# EAGLE board radiata_v1 (EAGLE 6.4)
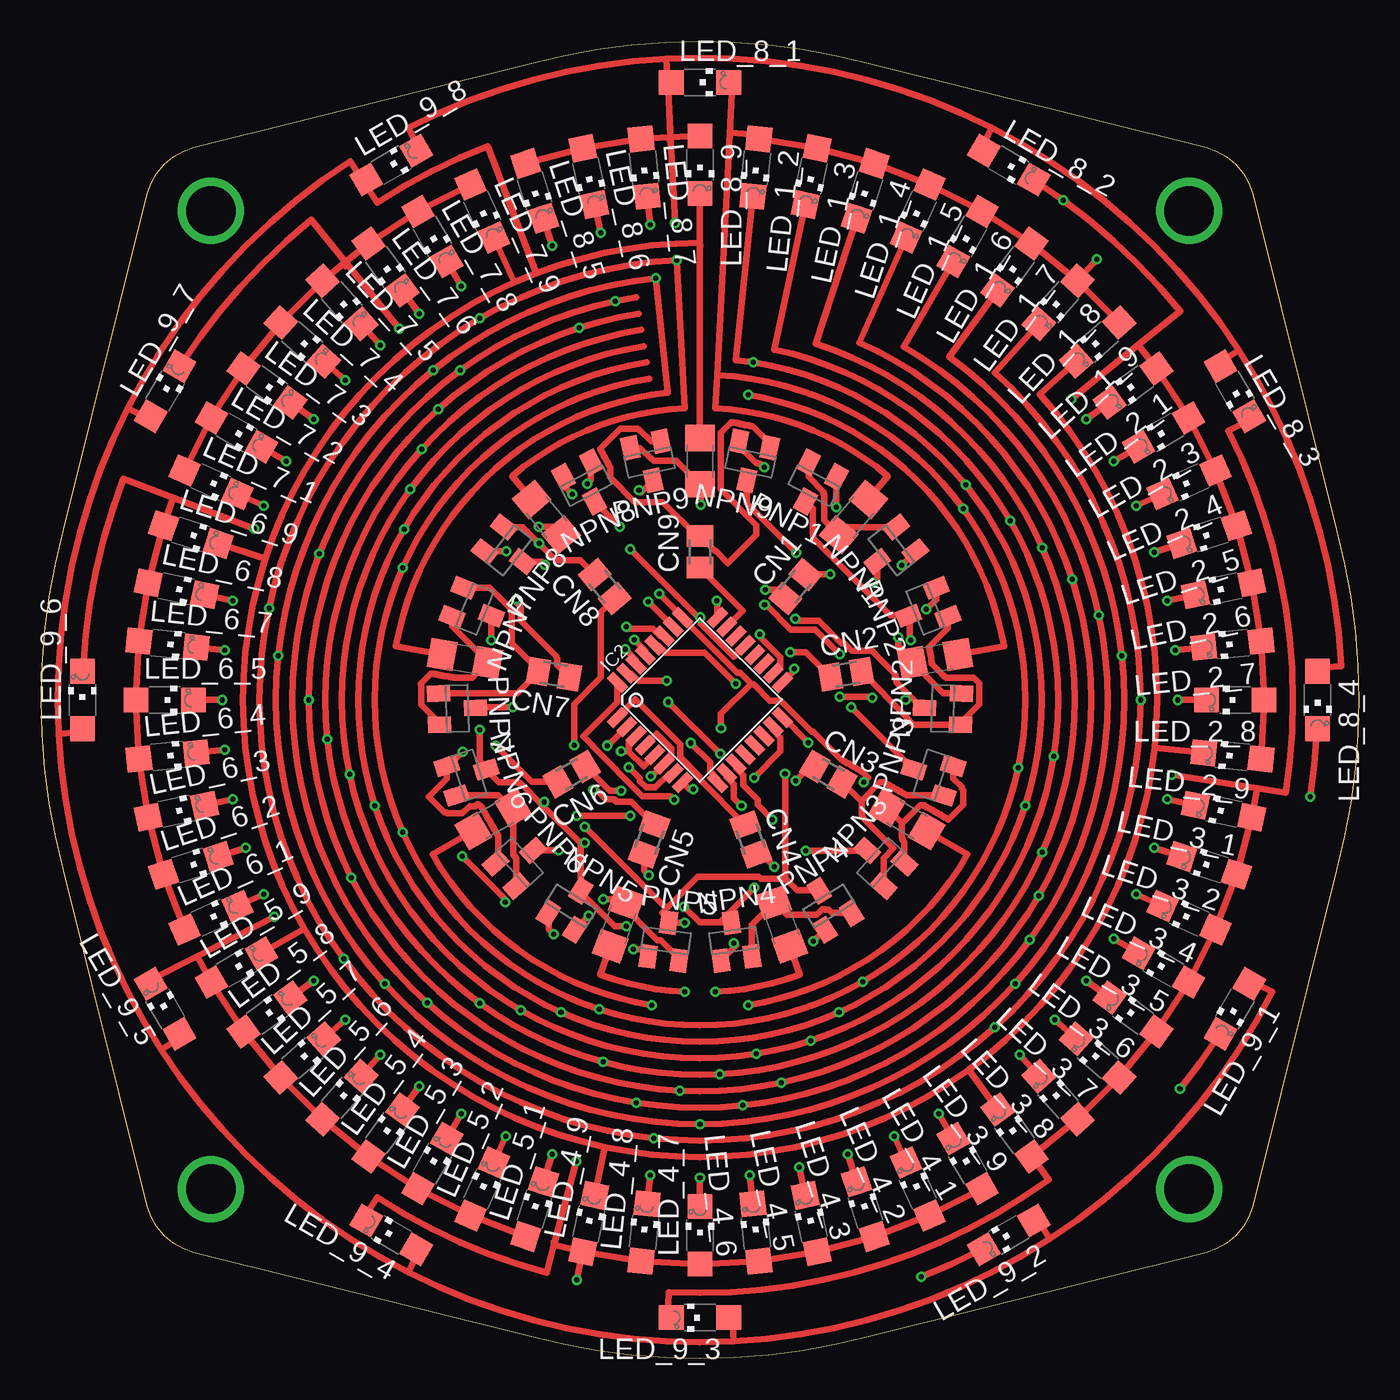
[diagram p1: board, top side]
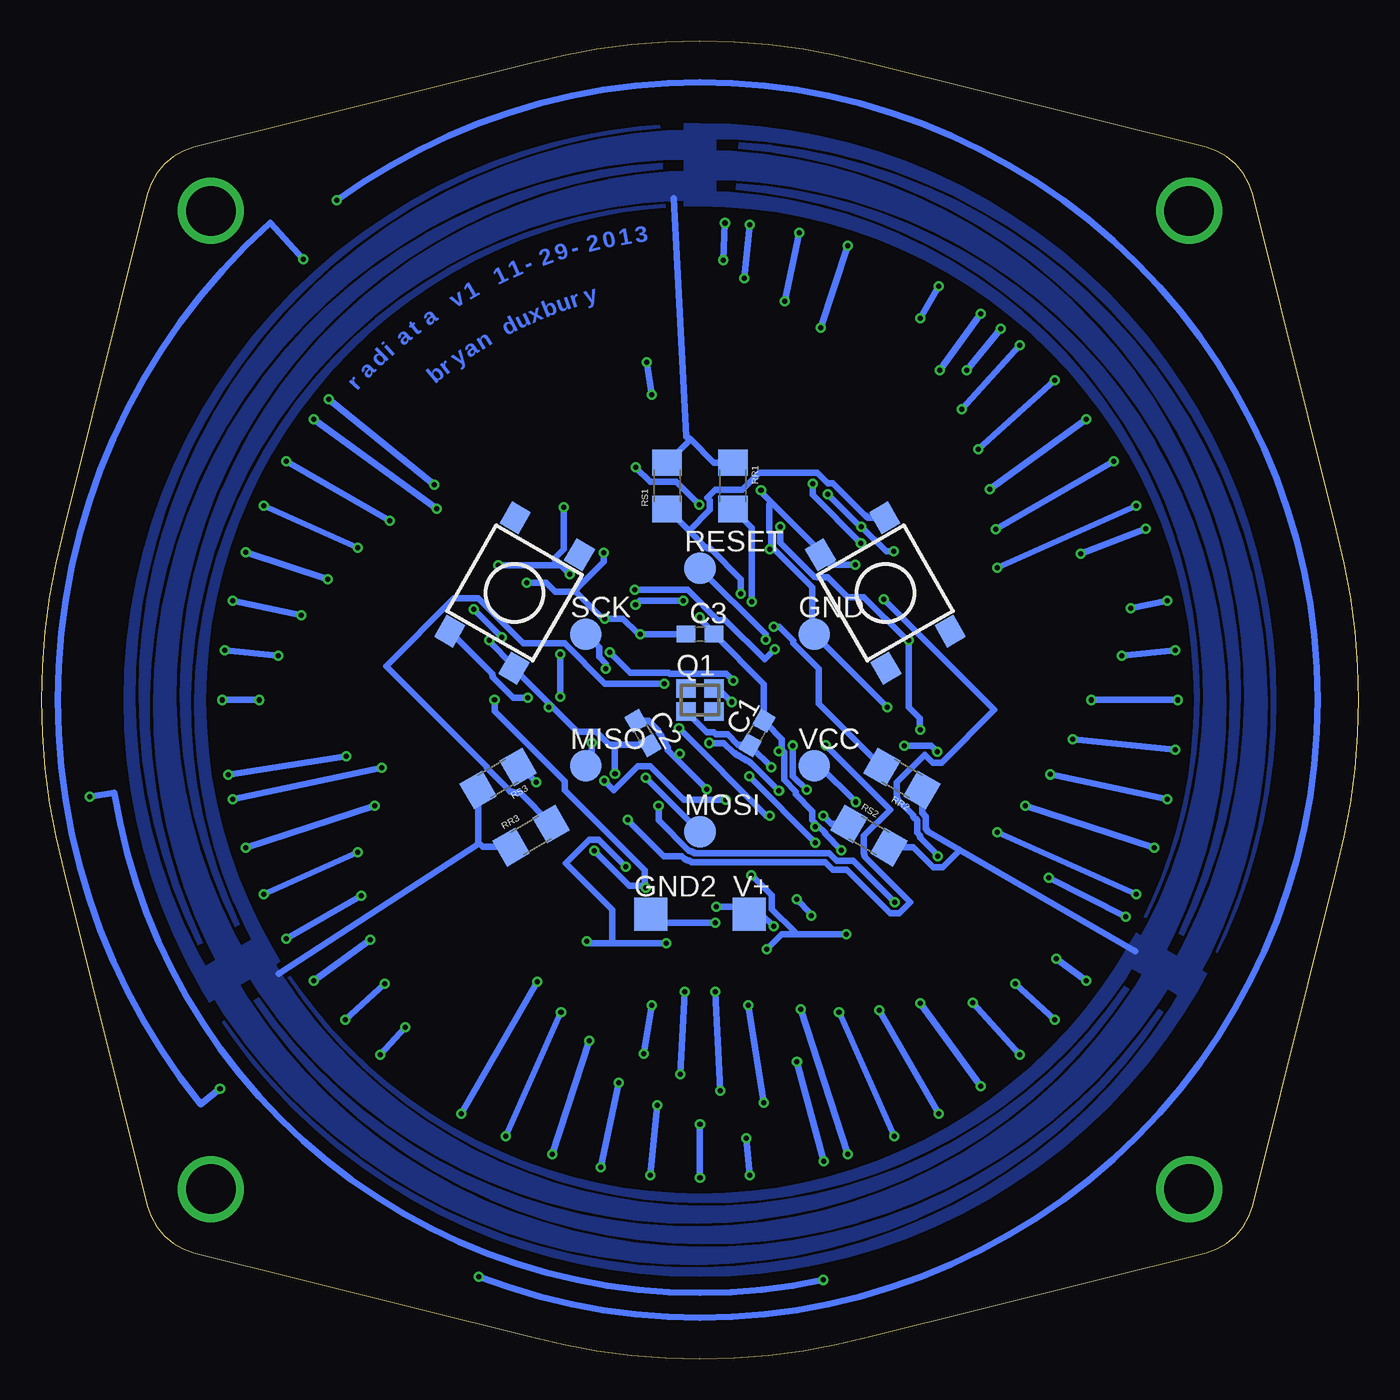
[diagram p2: board, bottom side, seen from below]

Size 80 x 80 mm. Coordinates in mm from the lower left corner, seen from the top.
Outline: 72 segments
Copper layers (1*16): Top 0.035mm / dielectric 0.2mm / Bottom 0.035mm
Design rules "SeeedStudio_DRU_no_angle_20130527 *": minimum track width 8mil, minimum drill 12mil, track to track 6mil, track to pad 6mil, pad to pad 6mil, via to via 6mil, smd to smd 0mil, copper to edge 10mil, drill to drill 10mil, minimum pad ring 6mil, minimum via ring 6mil, stop-mask expansion 2mil, vias tented up to drill 25mil, thermal gap 10mil
bRestrict: area 18.6,19 to 62.5,62.1; area 17.4,39.4 to 20.8,47

## Footprints (pad centres in the part's own frame; a part is rotated, then mirrored left to right if it is on the bottom)
C0603 = smd 1.1 x 1: 1 -0.85,0; 2 0.85,0
M0805 = smd 1.3 x 1.6: 1 -0.95,0; 2 0.95,0
TACTILE_SWITCH_TALL = smd 1.55 x 1.3: A1 -3.975,-2.25; A2 3.975,-2.25; B1 -3.975,2.25; B2 3.975,2.25
TP19R = smd 1.9 x 1.9: TP 0,0
TP20SQ = smd 2 x 2: TP 0,0
TQFP32-08 = smd 1.27 x 0.559: 1 -4.293,2.8; 2 -4.293,2; 3 -4.293,1.2; 4 -4.293,0.4; 5 -4.293,-0.4; 6 -4.293,-1.2; 7 -4.293,-2; 8 -4.293,-2.8; 17 4.293,-2.8; 18 4.293,-2; 19 4.293,-1.2; 20 4.293,-0.4; 21 4.293,0.4; 22 4.293,1.2; 23 4.293,2; 24 4.293,2.8 | smd 0.559 x 1.27: 9 -2.8,-4.293; 10 -2,-4.293; 11 -1.2,-4.293; 12 -0.4,-4.293; 13 0.4,-4.293; 14 1.2,-4.293; 15 2,-4.293; 16 2.8,-4.293; 25 2.8,4.293; 26 2,4.293; 27 1.2,4.293; 28 0.4,4.293; 29 -0.4,4.293; 30 -1.2,4.293; 31 -2,4.293; 32 -2.8,4.293
CHIPLED_1206 = smd 1.5 x 1.5: A 0,-1.75; C 0,1.75
SOT23-BEC = smd 1 x 1.4: B -0.95,-1.1; C 0,1.1; E 0.95,-1.1
FA-20H = smd 1.2 x 1.1: 1 -0.85,-0.7; 2 0.85,-0.7; 3 0.85,0.7; 4 -0.85,0.7
1206 = smd 1.6 x 1.8: 1 -1.4,0; 2 1.4,0

## Placement (x,y rotation side)
C1  [C0603]  36.54,38 60 bottom
C2  [C0603]  43.46,38 300 bottom
C3  [C0603]  40,44 0 bottom
CN1  [M0805]  45.79,46.89 50 top
CN2  [M0805]  48.86,41.56 10 top
CN3  [M0805]  47.79,35.5 330 top
CN4  [M0805]  43.08,31.54 290 top
CN5  [M0805]  36.92,31.54 250 top
CN6  [M0805]  32.21,35.5 210 top
CN7  [M0805]  31.14,41.56 170 top
CN8  [M0805]  34.21,46.89 130 top
CN9  [M0805]  40,49 90 top
DOWNSW  SWITCH-MOMENTARY-2  [TACTILE_SWITCH_TALL]  28.74,46.5 120 bottom
GND  PTR1TP19R  [TP19R]  33.07,44 0 bottom
GND2  PTR1TP20SQ  [TP20SQ]  43,27 0 bottom
IC2  MEGA48/88/168-AU  [TQFP32-08]  40,40 45 top
LED_1_2  [CHIPLED_1206]  43.4,72.32 174 top
LED_1_3  [CHIPLED_1206]  46.76,71.79 168 top
LED_1_4  [CHIPLED_1206]  50.04,70.91 162 top
LED_1_5  [CHIPLED_1206]  53.22,69.69 156 top
LED_1_6  [CHIPLED_1206]  56.25,68.15 150 top
LED_1_7  [CHIPLED_1206]  59.1,66.29 144 top
LED_1_8  [CHIPLED_1206]  61.75,64.15 138 top
LED_1_9  [CHIPLED_1206]  64.15,61.75 132 top
LED_2_1  [CHIPLED_1206]  66.29,59.1 126 top
LED_2_3  [CHIPLED_1206]  68.15,56.25 120 top
LED_2_4  [CHIPLED_1206]  69.69,53.22 114 top
LED_2_5  [CHIPLED_1206]  70.91,50.04 108 top
LED_2_6  [CHIPLED_1206]  71.79,46.76 102 top
LED_2_7  [CHIPLED_1206]  72.32,43.4 96 top
LED_2_8  [CHIPLED_1206]  72.5,40 90 top
LED_2_9  [CHIPLED_1206]  72.32,36.6 84 top
LED_3_1  [CHIPLED_1206]  71.79,33.24 78 top
LED_3_2  [CHIPLED_1206]  70.91,29.96 72 top
LED_3_4  [CHIPLED_1206]  69.69,26.78 66 top
LED_3_5  [CHIPLED_1206]  68.15,23.75 60 top
LED_3_6  [CHIPLED_1206]  66.29,20.9 54 top
LED_3_7  [CHIPLED_1206]  64.15,18.25 48 top
LED_3_8  [CHIPLED_1206]  61.75,15.85 42 top
LED_3_9  [CHIPLED_1206]  59.1,13.71 36 top
LED_4_1  [CHIPLED_1206]  56.25,11.85 30 top
LED_4_2  [CHIPLED_1206]  53.22,10.31 24 top
LED_4_3  [CHIPLED_1206]  50.04,9.09 18 top
LED_4_5  [CHIPLED_1206]  46.76,8.21 12 top
LED_4_6  [CHIPLED_1206]  43.4,7.68 6 top
LED_4_7  [CHIPLED_1206]  40,7.5 0 top
LED_4_8  [CHIPLED_1206]  36.6,7.68 354 top
LED_4_9  [CHIPLED_1206]  33.24,8.21 348 top
LED_5_1  [CHIPLED_1206]  29.96,9.09 342 top
LED_5_2  [CHIPLED_1206]  26.78,10.31 336 top
LED_5_3  [CHIPLED_1206]  23.75,11.85 330 top
LED_5_4  [CHIPLED_1206]  20.9,13.71 324 top
LED_5_6  [CHIPLED_1206]  18.25,15.85 318 top
LED_5_7  [CHIPLED_1206]  15.85,18.25 312 top
LED_5_8  [CHIPLED_1206]  13.71,20.9 306 top
LED_5_9  [CHIPLED_1206]  11.85,23.75 300 top
LED_6_1  [CHIPLED_1206]  10.31,26.78 294 top
LED_6_2  [CHIPLED_1206]  9.09,29.96 288 top
LED_6_3  [CHIPLED_1206]  8.21,33.24 282 top
LED_6_4  [CHIPLED_1206]  7.68,36.6 276 top
LED_6_5  [CHIPLED_1206]  7.5,40 270 top
LED_6_7  [CHIPLED_1206]  7.68,43.4 264 top
LED_6_8  [CHIPLED_1206]  8.21,46.76 258 top
LED_6_9  [CHIPLED_1206]  9.09,50.04 252 top
LED_7_1  [CHIPLED_1206]  10.31,53.22 246 top
LED_7_2  [CHIPLED_1206]  11.85,56.25 240 top
LED_7_3  [CHIPLED_1206]  13.71,59.1 234 top
LED_7_4  [CHIPLED_1206]  15.85,61.75 228 top
LED_7_5  [CHIPLED_1206]  18.25,64.15 222 top
LED_7_6  [CHIPLED_1206]  20.9,66.29 216 top
LED_7_8  [CHIPLED_1206]  23.75,68.15 210 top
LED_7_9  [CHIPLED_1206]  26.78,69.69 204 top
LED_8_1  [CHIPLED_1206]  40,77.5 270 top
LED_8_2  [CHIPLED_1206]  58.75,72.48 240 top
LED_8_3  [CHIPLED_1206]  72.48,58.75 210 top
LED_8_4  [CHIPLED_1206]  77.5,40 180 top
LED_8_5  [CHIPLED_1206]  29.96,70.91 198 top
LED_8_6  [CHIPLED_1206]  33.24,71.79 192 top
LED_8_7  [CHIPLED_1206]  36.6,72.32 186 top
LED_8_9  [CHIPLED_1206]  40,72.5 180 top
LED_9_1  [CHIPLED_1206]  72.48,21.25 150 top
LED_9_2  [CHIPLED_1206]  58.75,7.52 120 top
LED_9_3  [CHIPLED_1206]  40,2.5 90 top
LED_9_4  [CHIPLED_1206]  21.25,7.52 60 top
LED_9_5  [CHIPLED_1206]  7.52,21.25 30 top
LED_9_6  [CHIPLED_1206]  2.5,40 0 top
LED_9_7  [CHIPLED_1206]  7.52,58.75 330 top
LED_9_8  [CHIPLED_1206]  21.25,72.48 300 top
MISO  PTR1TP19R  [TP19R]  46.93,36 0 bottom
MOSI  PTR1TP19R  [TP19R]  40,32 0 bottom
NPN1  [SOT23-BEC]  51.62,49.08 128 top
NPN2  [SOT23-BEC]  54.74,39.49 88 top
NPN3  [SOT23-BEC]  50.96,30.13 48 top
NPN4  [SOT23-BEC]  42.05,25.39 8 top
NPN5  [SOT23-BEC]  32.18,27.49 328 top
NPN6  [SOT23-BEC]  25.97,35.44 288 top
NPN7  [SOT23-BEC]  26.32,45.53 248 top
NPN8  [SOT23-BEC]  33.08,53.02 208 top
NPN9  [SOT23-BEC]  43.07,54.43 168 top
PNP1  [SOT23-BEC]  46.92,53.02 152 top
PNP2  [SOT23-BEC]  53.68,45.53 112 top
PNP3  [SOT23-BEC]  54.03,35.44 72 top
PNP4  [SOT23-BEC]  47.82,27.49 32 top
PNP5  [SOT23-BEC]  37.95,25.39 352 top
PNP6  [SOT23-BEC]  29.04,30.13 312 top
PNP7  [SOT23-BEC]  25.26,39.49 272 top
PNP8  [SOT23-BEC]  28.38,49.08 232 top
PNP9  [SOT23-BEC]  36.93,54.43 192 top
Q1  FA-20H  [FA-20H]  40,40 0 bottom
RESET  PTR1TP19R  [TP19R]  40,48 0 bottom
RN1  [1206]  49.32,51.11 50 top
RN2  [1206]  54.28,42.52 10 top
RN3  [1206]  52.56,32.75 330 top
RN4  [1206]  44.96,26.37 290 top
RN5  [1206]  35.04,26.37 250 top
RN6  [1206]  27.44,32.75 210 top
RN7  [1206]  25.72,42.52 170 top
RN8  [1206]  30.68,51.11 130 top
RN9  [1206]  40,54.5 90 top
RR1  [1206]  38,53 270 bottom
RR2  [1206]  27.74,35.23 150 bottom
RR3  [1206]  50.26,31.77 30 bottom
RS1  [1206]  42,53 90 bottom
RS2  [1206]  29.74,31.77 330 bottom
RS3  [1206]  52.26,35.23 210 bottom
SCK  PTR1TP19R  [TP19R]  46.93,44 0 bottom
UPSW  SWITCH-MOMENTARY-2  [TACTILE_SWITCH_TALL]  51.26,46.5 240 bottom
V+  PTR1TP20SQ  [TP20SQ]  37,27 0 bottom
VCC  PTR1TP19R  [TP19R]  33.07,36 0 bottom

## Tracks (layer width: path | path; a pad name or v marks a point on that pad's centre or on a via)
GND  (via drill 0.3)
  Top 0.381: PNP1.C 46.43,52.05 46.84,51.64 46.84,50.11 46.86,50.09 46.86,49.84 51.56,45.14 52.65,45.14 PNP2.C 52.73,44.93 52.73,43.71 v52.81,43.64 | v49.17,39.55 52.93,35.79 52.96,35.79 PNP3.C | v28.63,39.55 26.36,39.55 PNP7.C | v30.58,48.21 30.4,48.39 29.26,48.39 PNP8.C | v36.3,52.73 36.42,52.6 PNP9.C | v39.06,26.47 38.12,26.47 PNP5.C 38.1,26.67 37.69,27.08 37.97,27.36 | 45.11,29.13 45.16,29.08 45.21,29.08 45.26,29.03 45.31,29.03 45.9,28.45 47.22,28.45 PNP4.C | 45.11,29.13 43.69,29.13 43.56,29.26 39.88,29.26 37.97,27.36 | 37.24,36.68 IC2.5 37.13,36.52 36.58,35.97 35.69,36.85 | IC2.3 35.99,37.67 35.69,37.36 35.69,36.85 | IC2.21 42.75,43.31 42.06,42.62 40.06,44.63 40.06,44.96 v40.01,45.01 39.83,45.09 v35.76,49.15 | v31.42,30.89 29.87,30.89 PNP6.C | v35.2,36.88 35.51,36.88 35.69,36.85 | v32.99,32.31 37.82,27.48 37.85,27.48 37.97,27.36 | v45.16,35.53 45.16,29.31 45.11,29.13
  Bottom 0.381: 45.16,37.29 45.52,37.29 46.3,38.08 47.45,38.08 49.05,39.67 | 45.16,37.29 43.05,37.29 C2.2 | 49.05,39.67 51.28,41.91 UPSW.B2 51.36,42.11 52.81,43.56 v52.81,43.64 | v49.17,39.55 49.05,39.67 | v28.63,39.55 GND.TP 33.17,44.17 33.17,46.84 35.61,49.28 | v30.58,48.21 32.08,48.21 32.66,48.79 DOWNSW.B2 32.66,49 35.66,51.99 | v36.3,52.73 36.3,52.63 35.66,51.99 | 35.61,49.28 35.66,49.33 35.66,50.11 35.79,50.24 35.79,51.87 35.66,51.99 | v39.06,26.47 42.47,26.47 42.98,26.98 GND2.TP | v40.01,45.01 40.01,44.93 39.24,44.17 C3.2 36.12,40.97 36.12,38.76 C1.2 35.99,38.58 35.03,37.62 35.03,36.96 | v31.42,30.89 32.41,31.88 32.41,31.93 32.89,32.41 | 32.89,32.41 33.17,32.69 33.17,33.25 34.19,34.27 34.19,34.44 34.9,35.15 34.9,36.83 35.03,36.96 | v35.2,36.88 35.03,36.96 | v32.99,32.31 32.89,32.41 | v35.76,49.15 35.74,49.15 35.61,49.28 | v45.16,35.53 45.16,37.29
N$1  (via drill 3)
  other vias: 10.3,10.3
N$2  (via drill 3)
  other vias: 10.3,69.7
N$3  (via drill 3)
  other vias: 69.7,69.7
N$4  (via drill 3)
  other vias: 69.7,10.3
N$5  (via drill 0.3)
  Top 0.381: v36.02,43.66 36.68,43 36.68,42.77 IC2.29
  Bottom 0.381: v36.02,43.66 36.02,43.99 40.01,47.98 RESET.TP
N$6  (via drill 0.3)
  Top 0.381: v45.72,41.91 45.8,41.83 45.03,41.07 IC2.17
  Bottom 0.381: v45.72,41.91 45.72,42.22 46.13,42.62 46.13,43.2 46.91,43.99 SCK.TP
N$7  (via drill 0.3)
  Top 0.381: v46.58,37.41 45.06,38.94 45.03,38.94 IC2.16
  Bottom 0.381: v46.58,37.41 46.58,36.35 46.91,36.02 MISO.TP
N$8  (via drill 0.3)
  Top 0.381: v43.28,35.28 44.88,36.88 44.88,37.72 44.45,38.15 44.45,38.35 IC2.15
  Bottom 0.381: v43.28,35.28 MOSI.TP
N$9
  Top 0.381: PNP1.E 46.61,53.54 47.5,52.65 47.5,52.58 47.52,52.55 47.52,52.5 47.55,52.48 47.55,50.9 RN1.1 48.21,50.49 51.89,50.49 NPN1.E
N$10  (via drill 0.3)
  Top 0.381: v52.25,48.18 53.06,49 NPN1.B | v47.9,47.62 CN1.2 | v48.28,51.69 PNP1.B
  Bottom 0.381: 48.62,48.18 48.46,48.18 v47.9,47.62 | 48.62,48.18 v52.25,48.18 | v48.28,51.69 48.28,49.15 48.84,48.59 48.62,48.36 48.62,48.18
N$11  (via drill 0.3)
  Top 0.381: NPN2.E 55.85,40.41 54.76,40.41 RN2.1 52.86,42.47 52.05,43.28 v52.05,43.81 | v53.75,45.52 54.33,46.1 PNP2.E
  Bottom 0.381: v52.05,43.81 v53.75,45.52
N$12
  Top 0.381: CN2.2 49.81,41.71 52.55,38.96 52.55,38.91 52.96,38.51 NPN2.B 55.88,38.68 56.95,39.75 56.95,41.02 56.62,41.35 54.94,41.35 54.86,41.43 54.81,41.43 54.69,41.55 54.69,41.58 54.08,42.19 54.08,42.32 54.05,42.34 54.05,42.47 54.03,42.49 54.03,42.62 54,42.65 54,42.75 53.98,42.77 53.98,42.9 53.95,42.93 53.95,43.05 53.92,43.08 53.92,43.18 53.9,43.2 55.04,44.35 55.04,45.03 PNP2.B
N$13
  Top 0.381: 52.25,32.54 52.25,31.67 52.27,31.65 52.27,31.57 52.3,31.55 52.3,31.47 52.4,31.37 52.4,30.12 NPN3.E | 52.25,32.54 51.36,33.43 RN3.1 | PNP3.E 55.37,35.99 55.37,35.23 55.88,34.72 55.88,34.67 55.93,34.62 55.93,34.57 55.98,34.52 55.98,33.66 55.07,32.74 54.99,32.82 54.94,32.82 54.86,32.89 54.81,32.89 54.76,32.94 54.71,32.94 54.63,33.02 54.59,33.02 54.51,33.1 54.46,33.1 54.41,33.15 54.36,33.15 54.28,33.22 54.23,33.22 54.15,33.3 54.1,33.3 54.03,33.38 53.98,33.38 53.92,33.43 53.87,33.43 53.8,33.5 53.75,33.5 53.67,33.58 53.62,33.58 53.59,33.6 53.37,33.6 52.4,32.64 52.25,32.54
N$14
  Top 0.381: 49.81,33.83 49.81,33.12 49.84,33.1 49.84,33.05 49.86,33.02 49.86,32.94 49.89,32.92 49.89,32.84 51.74,30.99 51.16,30.4 51.16,28.7 NPN3.B | 49.81,33.83 48.64,35 CN3.2 | PNP3.B 54.76,34.21 52.53,34.21 52.48,34.27 52.43,34.27 52.35,34.34 52.3,34.34 52.22,34.42 52.17,34.42 52.12,34.47 52.07,34.47 51.99,34.54 51.94,34.54 51.87,34.62 51.82,34.62 51.74,34.7 51.69,34.7 51.64,34.75 51.59,34.75 51.51,34.82 51.46,34.82 51.38,34.9 51.33,34.9 51.26,34.98 51.21,34.98 51.18,35 50.93,35 49.91,33.98 49.81,33.83
N$15
  Top 0.381: NPN4.E 43.16,24.46 43.16,26.36 RN4.1 44.65,27.58 45.26,26.98 47.09,26.98 47.42,27.3 47.57,27.3 47.6,27.28 47.68,27.28 47.7,27.25 47.83,27.25 48.01,27.08 49.2,27.08 PNP4.E
N$16  (via drill 0.3)
  Top 0.381: v42.06,25.22 42.19,25.09 41.27,24.18 NPN4.B | v46.89,25.35 47.57,26.04 PNP4.B | v44.5,29.87 43.74,30.63 43.41,30.63 CN4.2
  Bottom 0.381: 45.34,25.22 46.76,25.22 v46.89,25.35 | 45.34,25.22 v42.06,25.22 | v44.5,29.87 46.15,31.52 46.71,31.52 48.16,30.07 45.34,27.25 45.34,25.22
N$17  (via drill 0.3)
  Top 0.381: v33.25,26.9 NPN5.E | v34.14,27.89 35.33,27.89 35.51,27.71 RN5.1 35.13,27.71 37.41,25.43 37.49,25.43 37.52,25.4 37.62,25.4 38.71,24.31 38.71,24.18 PNP5.E
  Bottom 0.381: v33.25,26.9 33.25,27 v34.14,27.89
N$18  (via drill 0.3)
  Top 0.381: v31.11,25.78 30.81,26.09 NPN5.B | v35.94,24.87 36.42,24.87 36.83,24.46 PNP5.B | v36.88,29.36 36.6,29.64 36.6,30.63 CN5.2
  Bottom 0.381: 34.29,25.78 35.03,25.78 v35.94,24.87 | 34.29,25.78 v31.11,25.78 | v36.88,29.36 36.85,29.36 35.64,28.14 35.64,27.3 34.29,25.96 34.29,25.78
N$19
  Top 0.381: PNP6.E 28.85,28.7 28.85,30.4 28.65,30.61 28.65,33.43 RN6.1 28.47,33.5 27.76,34.21 25.22,34.21 NPN6.E
N$20  (via drill 0.3)
  Top 0.381: PNP6.B 27.61,30.12 27.76,30.28 27.76,31.75 27.69,31.83 27.69,31.88 27.61,31.95 27.61,32 27.53,32.08 27.53,32.13 27.48,32.18 27.48,32.23 27.41,32.31 27.41,32.36 27.33,32.44 27.33,32.49 27.25,32.56 27.25,32.61 27.2,32.66 27.2,32.72 27.13,32.79 27.13,32.84 27.05,32.92 27.05,32.97 27,33.02 27,33.07 26.92,33.15 26.92,33.2 26.85,33.27 26.85,33.33 26.77,33.4 26.77,33.45 26.54,33.68 26.47,33.68 26.34,33.55 26.01,33.55 25.58,33.12 24.66,33.12 24.64,33.15 24.59,33.15 24.54,33.2 24.49,33.2 23.55,34.14 24.61,35.2 24.61,35.99 NPN6.B 24.82,36.07 v25.6,36.85 | v27.61,37.21 29.79,35.03 CN6.2
  Bottom 0.381: v27.61,37.21 25.96,37.21 v25.6,36.85
N$24
  Top 0.381: PNP7.E 24.18,38.63 23.09,39.73 23.09,40.23 23.06,40.26 23.06,40.95 23.04,40.97 23.04,41 23.65,41.6 23.72,41.6 23.75,41.58 23.88,41.58 23.9,41.55 24,41.55 24.03,41.53 24.16,41.53 24.18,41.5 24.31,41.5 24.33,41.48 24.43,41.48 24.46,41.45 24.59,41.45 24.61,41.43 24.74,41.43 24.77,41.4 24.87,41.4 24.89,41.38 25.02,41.38 25.04,41.35 26.16,41.35 27.08,42.27 RN7.1 27,42.44 24.97,44.48 24.97,45.03 NPN7.E
N$25
  Top 0.381: PNP7.B 24.13,40.41 28.91,40.41 30.2,41.71 CN7.2 30.12,41.91 28.57,43.46 28.57,45.34 28.52,45.39 28.52,45.47 28.47,45.52 28.47,45.57 27.23,46.81 25.68,46.81 NPN7.B
N$26  (via drill 0.3)
  Top 0.381: v28.25,49.02 26.95,49.02 PNP8.E | v30.2,50.52 31.09,50.52 RN8.1 | v32.23,52.5 31.73,53.01 NPN8.E
  Bottom 0.381: v28.25,49.02 28.7,49.02 v30.2,50.52 30.35,50.62 v32.23,52.5
N$27  (via drill 0.3)
  Top 0.381: 30.21,49.52 31.24,48.49 32.74,48.49 CN8.2 | 30.21,49.52 29.23,50.49 28.12,50.49 PNP8.B | v33.15,53.14 33.38,53.37 33.38,54.43 NPN8.B | v30.23,49.53 30.21,49.52
  Bottom 0.381: v33.15,53.14 33.15,52.45 v30.23,49.53
N$28  (via drill 0.3)
  Top 0.381: PNP9.E 35.79,55.3 36.37,55.3 37.03,54.63 37.08,54.63 37.19,54.53 38.56,54.53 39.98,53.11 RN9.1 40.01,52.91 40.06,52.86 v40.06,51.84 | v43.89,54.13 43.66,54.36 43.56,54.36 43.54,54.38 43.46,54.38 43.43,54.41 43.38,54.41 42.37,55.42 42.37,55.68 NPN9.E
  Bottom 0.381: v43.89,54.13 43.89,54.1 43.03,53.24 41.45,53.24 v40.06,51.84
N$29
  Top 0.381: NPN9.B 44.22,55.6 43.2,56.62 43.08,56.62 43.05,56.64 42.98,56.64 42.95,56.67 42.85,56.67 42.82,56.69 42.72,56.69 42.7,56.72 42.62,56.72 42.6,56.74 42.49,56.74 42.47,56.77 42.37,56.77 42.34,56.79 42.24,56.79 42.22,56.82 42.14,56.82 42.11,56.84 42.01,56.84 41.99,56.87 41.88,56.87 41.25,56.24 41.25,52.78 43.41,50.62 43.41,50.04 41.68,48.31 40.95,49.05 40.89,49.05 40.01,49.94 CN9.2 39.8,49.96 37.74,52.02 36.04,52.02 34.54,53.52 34.54,54.13 34.49,54.18 34.49,54.23 34.44,54.28 34.44,54.33 34.39,54.38 34.39,54.43 34.34,54.48 34.34,54.53 34.27,54.61 34.27,54.66 34.21,54.71 34.21,54.76 34.16,54.81 34.16,54.86 34.09,54.94 34.09,54.99 34.04,55.04 34.04,55.09 33.98,55.14 33.98,55.19 33.93,55.24 35.15,56.46 36.22,56.46 36.27,56.41 36.32,56.41 37.03,55.7 37.62,55.7 PNP9.B
N_1  (via drill 0.3)
  Top 0.381: LED_1_8.A LED_1_7.A LED_1_6.A LED_1_5.A LED_1_4.A LED_1_3.A LED_1_2.A 43.51,74.24 43.52,74.32 | LED_1_8.A LED_1_9.A | 36.91,59.51 35.89,59.32 34.89,59.08 33.9,58.78 32.92,58.44 31.97,58.04 31.03,57.6 30.12,57.1 29.24,56.56 28.39,55.98 27.57,55.35 26.79,54.68 26.04,53.97 25.32,53.22 24.65,52.43 24.02,51.61 23.44,50.76 22.9,49.88 22.4,48.97 v21.96,48.03 21.56,47.08 21.22,46.1 20.92,45.11 20.68,44.11 20.49,43.09 20.36,42.06 20.28,41.03 20.25,40 20.28,38.97 20.36,37.94 20.49,36.91 20.68,35.89 20.92,34.89 21.22,33.9 21.56,32.92 v21.96,31.97 22.4,31.03 22.9,30.12 23.44,29.24 24.02,28.39 24.65,27.57 25.32,26.79 26.04,26.04 26.79,25.32 27.57,24.65 28.39,24.02 29.24,23.44 30.12,22.9 31.03,22.4 31.97,21.96 32.92,21.56 v33.9,21.22 34.89,20.92 35.89,20.68 36.91,20.49 37.94,20.36 38.97,20.28 40,20.25 41.03,20.28 42.06,20.36 43.09,20.49 44.11,20.68 45.11,20.92 46.1,21.22 47.08,21.56 48.03,21.96 48.97,22.4 v49.88,22.9 50.76,23.44 51.61,24.02 52.43,24.65 53.22,25.32 53.97,26.04 54.68,26.79 55.35,27.57 55.98,28.39 56.56,29.24 57.1,30.12 57.6,31.03 58.04,31.97 58.44,32.92 58.78,33.9 59.08,34.89 v59.32,35.89 59.51,36.91 59.64,37.94 59.72,38.97 59.75,40 59.72,41.03 59.64,42.06 59.51,43.09 59.32,44.11 59.08,45.11 58.78,46.1 58.44,47.08 58.04,48.03 57.6,48.97 57.1,49.88 56.56,50.76 v55.98,51.61 55.35,52.43 54.68,53.22 53.97,53.97 53.22,54.68 52.43,55.35 51.61,55.98 50.76,56.56 49.88,57.1 48.97,57.6 48.03,58.04 47.08,58.44 46.1,58.78 45.11,59.08 44.11,59.32 43.09,59.51 42.06,59.64 41.03,59.72 | 41.03,59.72 41.7,72.45
  Top 0.381: 41.7,72.45 41.81,74.45 43.52,74.32 | 43.52,74.32 43.61,74.31 | 41.03,59.72 40.93,57.73 41.81,57.66 42.68,57.55 43.55,57.39 44.41,57.19 45.26,56.95 46.09,56.67 46.91,56.35 47.72,55.98 48.5,55.58 49.26,55.14 50.01,54.66 50.72,54.15 51.41,53.6 50.28,52.26 RN1.2 | 41.7,72.45 41.96,77.45 41.78,77.5 LED_8_1.C | v69.14,16.4 70.34,17.96 71.45,19.58 71.58,19.71 LED_9_1.C | v64.09,66.75 63.09,65.64 62.92,65.68 LED_1_8.A | LED_2_1.C v63.46,57.05 | LED_3_1.C v68.37,33.97 | LED_4_1.C v54.5,14.88 | LED_5_1.C v31.04,12.42 | LED_6_1.C v13.51,28.2 | LED_7_1.C v13.51,51.8
  Bottom 0.381: v69.14,16.4 70.31,15.46 71.55,17.08 72.71,18.76 73.78,20.5 74.75,22.29 75.63,24.14 76.41,26.02 77.09,27.95 77.67,29.91 78.15,31.89 78.52,33.9 78.79,35.92 78.95,37.96 79,40 78.95,42.04 78.79,44.08 78.52,46.1 78.15,48.11 77.67,50.09 77.09,52.05 76.41,53.98 75.63,55.86 74.75,57.71 73.78,59.5 72.71,61.24 71.55,62.92 70.31,64.54 68.98,66.1 67.58,67.58 66.1,68.98 v64.09,66.75 | v63.46,57.05 v55.98,51.61 | v68.37,33.97 v59.32,35.89 | v54.5,14.88 v49.88,22.9 | v31.04,12.42 v33.9,21.22 | v13.51,28.2 v21.96,31.97 | v13.51,51.8 v21.96,48.03
N_2  (via drill 0.3)
  Top 0.381: LED_2_9.A LED_2_8.A LED_2_7.A LED_2_6.A LED_2_5.A LED_2_4.A LED_2_3.A LED_2_1.A 66.62,61.55 | 36.75,60.49 35.69,60.3 34.63,60.04 33.59,59.73 32.56,59.37 31.56,58.96 30.58,58.49 29.62,57.97 28.7,57.4 27.8,56.79 26.94,56.13 26.12,55.42 25.33,54.67 24.58,53.88 23.87,53.06 23.21,52.2 22.6,51.3 v22.03,50.38 21.51,49.42 21.04,48.44 20.63,47.44 20.27,46.41 19.96,45.37 19.7,44.31 19.5,43.25 19.36,42.17 19.28,41.09 19.25,40 19.28,38.91 19.36,37.83 19.5,36.75 19.7,35.69 19.96,34.63 v20.27,33.59 20.63,32.56 21.04,31.56 21.51,30.58 22.03,29.62 22.6,28.7 23.21,27.8 23.87,26.94 24.58,26.12 25.33,25.33 26.12,24.58 26.94,23.87 27.8,23.21 28.7,22.6 29.62,22.03 30.58,21.51 v31.56,21.04 32.56,20.63 33.59,20.27 34.63,19.96 35.69,19.7 36.75,19.5 37.83,19.36 38.91,19.28 40,19.25 41.09,19.28 42.17,19.36 43.25,19.5 44.31,19.7 45.37,19.96 46.41,20.27 47.44,20.63 v48.44,21.04 49.42,21.51 50.38,22.03 51.3,22.6 52.2,23.21 53.06,23.87 53.88,24.58 54.67,25.33 55.42,26.12 56.13,26.94 56.79,27.8 57.4,28.7 57.97,29.62 58.49,30.58 58.96,31.56 59.37,32.56 v59.73,33.59 60.04,34.63 60.3,35.69 60.49,36.75 60.64,37.83 60.72,38.91 60.75,40 60.72,41.09 60.64,42.17 60.49,43.25 60.3,44.31 60.04,45.37 59.73,46.41 59.37,47.44 58.96,48.44 58.49,49.42 57.97,50.38 57.4,51.3 56.79,52.2 v56.13,53.06 55.42,53.88 54.67,54.67 53.88,55.42 53.06,56.13 52.2,56.79 51.3,57.4 50.38,57.97 49.42,58.49 48.44,58.96 47.44,59.37 46.41,59.73 45.37,60.04 44.31,60.3 v43.25,60.49 42.17,60.64 LED_1_2.C | v42.93,58.52 43.88,58.34 44.83,58.12 45.76,57.84 46.67,57.52 47.56,57.16 48.44,56.74 49.29,56.28 50.12,55.78 50.92,55.24 51.69,54.66 52.43,54.03 53.14,53.37 53.81,52.68 54.45,51.95 55.05,51.19 55.6,50.39 56.12,49.58 56.59,48.73 57.02,47.86 57.41,46.97 57.74,46.07 58.03,45.14 58.27,44.2 58.47,43.26 55.76,42.78 55.68,42.77 RN2.2
  Top 0.381: 66.62,61.55 69.14,63.6 67.87,65.09 66.52,66.52 65.09,67.87 63.6,69.14 v62.04,70.34 60.42,71.45 60.3,71.6 LED_8_2.C | 66.62,61.55 v62.54,58.25 | v53.44,4.99 55.25,5.74 57.02,6.59 57.2,6.66 LED_9_2.C | LED_3_2.C v67.58,31.04 | LED_4_2.C v51.8,13.51 | LED_5_2.C v28.2,13.51 | LED_6_2.C v12.42,31.04 | LED_7_2.C v14.88,54.5
  Bottom 0.381: v62.54,58.25 v56.13,53.06 | v42.93,58.52 v43.25,60.49 | v62.04,70.34 60.42,71.45 58.75,72.48 57.02,73.41 55.25,74.26 53.44,75.01 51.59,75.67 49.71,76.22 47.8,76.68 45.87,77.04 43.92,77.3 41.96,77.45 40,77.5 38.04,77.45 36.08,77.3 34.13,77.04 32.2,76.68 30.29,76.22 28.41,75.67 26.56,75.01 24.75,74.26 22.98,73.41 21.25,72.48 19.58,71.45 17.96,70.34 16.4,69.14 14.91,67.87 13.48,66.52 12.13,65.09 10.86,63.6 9.66,62.04 8.55,60.42 7.52,58.75 6.59,57.02 5.74,55.25 4.99,53.44 4.33,51.59 3.78,49.71 3.32,47.8 2.96,45.87 2.71,43.92 2.55,41.96 2.5,40 2.55,38.04 2.71,36.08 2.96,34.13 3.32,32.2 3.78,30.29 4.33,28.41 4.99,26.56 5.74,24.75 6.59,22.98 7.52,21.25 8.55,19.58 9.66,17.96 10.86,16.4 12.13,14.91 13.48,13.48 14.91,12.13 16.4,10.86 17.96,9.66 19.58,8.55 21.25,7.52 22.98,6.59 24.75,5.74 26.56,4.99 28.41,4.33 30.29,3.78 32.2,3.32 34.13,2.96 36.08,2.71 38.04,2.55 40,2.5 41.96,2.55 43.92,2.71 45.87,2.96 47.8,3.32 49.71,3.78 51.59,4.33 v53.44,4.99 | v67.58,31.04 v59.73,33.59 | v51.8,13.51 v48.44,21.04 | v28.2,13.51 v31.56,21.04 | v12.42,31.04 v20.27,33.59 | v14.88,54.5 v22.03,50.38
N_3  (via drill 0.3)
  Top 0.381: 36.6,61.48 35.48,61.27 34.37,61.01 33.28,60.69 32.2,60.3 31.15,59.87 30.13,59.38 29.12,58.84 28.15,58.24 27.22,57.6 26.31,56.9 25.45,56.16 24.62,55.38 23.84,54.55 23.1,53.69 v22.4,52.78 21.76,51.85 21.16,50.88 20.62,49.87 20.13,48.85 19.7,47.8 19.32,46.72 18.99,45.63 18.73,44.52 18.52,43.4 18.37,42.27 18.28,41.14 18.25,40 18.28,38.86 18.37,37.73 18.52,36.6 v18.73,35.48 18.99,34.37 19.32,33.28 19.7,32.2 20.13,31.15 20.62,30.13 21.16,29.12 21.76,28.15 22.4,27.22 23.1,26.31 23.84,25.45 24.62,24.62 25.45,23.84 26.31,23.1 27.22,22.4 28.15,21.76 v29.12,21.16 30.13,20.62 31.15,20.13 32.2,19.7 33.28,19.32 34.37,18.99 35.48,18.73 36.6,18.52 37.73,18.37 38.86,18.28 40,18.25 41.14,18.28 42.27,18.37 v43.4,18.52 44.52,18.73 45.63,18.99 v46.72,19.32 47.8,19.7 48.85,20.13 49.87,20.62 50.88,21.16 51.85,21.76 52.78,22.4 53.69,23.1 54.55,23.84 55.38,24.62 56.16,25.45 56.9,26.31 57.6,27.22 58.24,28.15 58.84,29.12 59.38,30.13 59.87,31.15 60.3,32.2 60.69,33.28 61.01,34.37 61.27,35.48 v61.48,36.6 61.63,37.73 61.72,38.86 61.75,40 61.72,41.14 61.63,42.27 61.48,43.4 61.27,44.52 61.01,45.63 60.69,46.72 60.3,47.8 59.87,48.85 59.38,49.87 v58.84,50.88 58.24,51.85 57.6,52.78 56.9,53.69 56.16,54.55 55.38,55.38 54.55,56.16 53.69,56.9 52.78,57.6 51.85,58.24 50.88,58.84 49.87,59.38 48.85,59.87 47.8,60.3 46.72,60.69 45.63,61.01 44.52,61.27 LED_1_3.C | v42.93,21.48 43.9,21.66 44.85,21.89 45.79,22.17 46.72,22.5 47.63,22.87 48.51,23.29 49.38,23.76 50.21,24.27 51.02,24.83 51.8,25.43 52.55,26.07 53.26,26.74 53.93,27.45 54.57,28.2 55.17,28.98 55.73,29.79 56.24,30.62 53.86,32 53.77,32.03 RN3.2
  Top 0.381: 73.83,34.64 75.56,34.37 75.8,36.24 75.95,38.12 76,40 75.95,41.88 75.8,43.76 75.56,45.63 75.21,47.48 74.77,49.32 74.24,51.12 73.61,52.9 72.89,54.64 72.08,56.34 73.41,57.02 73.36,57.2 LED_8_3.C | 73.83,34.64 v68.64,35.46 | 73.83,34.64 LED_3_1.A LED_3_2.A LED_3_4.A LED_3_5.A LED_3_6.A LED_3_7.A LED_3_8.A LED_3_9.A 61.16,10.88 59.61,9.81 58,8.82 56.34,7.92 54.64,7.11 52.9,6.39 51.12,5.76 49.32,5.23 47.48,4.79 45.63,4.44 43.76,4.2 41.88,4.05 40,4 38.12,4.05 38.04,2.55 38.2,2.49 38.23,2.49 LED_9_3.C | LED_2_3.C v65.11,54.5 | LED_4_3.C v48.96,12.42 | LED_5_3.C v25.5,14.88 | LED_6_3.C v11.63,33.97 | LED_7_3.C v16.54,57.05
  Bottom 0.381: v42.93,21.48 v43.4,18.52 | v68.64,35.46 v61.48,36.6 | v65.11,54.5 v58.84,50.88 | v48.96,12.42 v46.72,19.32 | v25.5,14.88 v29.12,21.16 | v11.63,33.97 v18.73,35.48 | v16.54,57.05 v22.4,52.78
N_4  (via drill 0.3)
  Top 0.381: LED_4_1.A LED_4_2.A LED_4_3.A LED_4_5.A LED_4_6.A LED_4_7.A LED_4_8.A LED_4_9.A | 36.44,62.47 35.27,62.25 34.11,61.98 32.97,61.64 31.85,61.24 30.75,60.78 29.67,60.27 28.62,59.7 27.61,59.08 26.63,58.41 25.68,57.68 24.78,56.91 23.91,56.09 v23.09,55.22 22.32,54.32 21.59,53.37 20.92,52.39 20.3,51.38 19.73,50.33 19.22,49.25 18.76,48.15 18.36,47.03 18.02,45.89 17.75,44.73 17.53,43.56 17.38,42.38 17.28,41.19 17.25,40 17.28,38.81 v17.38,37.62 17.53,36.44 17.75,35.27 18.02,34.11 18.36,32.97 18.76,31.85 19.22,30.75 19.73,29.67 20.3,28.62 20.92,27.61 21.59,26.63 22.32,25.68 23.09,24.78 23.91,23.91 24.78,23.09 25.68,22.32 v26.63,21.59 27.61,20.92 28.62,20.3 29.67,19.73 30.75,19.22 31.85,18.76 32.97,18.36 v34.11,18.02 35.27,17.75 36.44,17.53 37.62,17.38 38.81,17.28 40,17.25 v41.19,17.28 42.38,17.38 43.56,17.53 44.73,17.75 45.89,18.02 47.03,18.36 48.15,18.76 49.25,19.22 50.33,19.73 51.38,20.3 52.39,20.92 53.37,21.59 54.32,22.32 55.22,23.09 56.09,23.91 56.91,24.78 57.68,25.68 58.41,26.63 59.08,27.61 59.7,28.62 60.27,29.67 v60.78,30.75 61.24,31.85 61.64,32.97 61.98,34.11 62.25,35.27 62.47,36.44 62.62,37.62 62.72,38.81 62.75,40 62.72,41.19 62.62,42.38 62.47,43.56 62.25,44.73 61.98,45.89 61.64,47.03 61.24,48.15 v60.78,49.25 60.27,50.33 59.7,51.38 59.08,52.39 58.41,53.37 57.68,54.32 56.91,55.22 56.09,56.09 55.22,56.91 54.32,57.68 53.37,58.41 52.39,59.08 51.38,59.7 50.33,60.27 49.25,60.78 48.15,61.24 47.03,61.64 LED_1_4.C | v40.93,22.27 41.8,22.34 42.67,22.45 43.54,22.61 44.39,22.8 45.24,23.04 46.07,23.32 45.47,24.96 RN4.2
  Top 0.381: 31.14,6.92 30.68,5.23 28.88,5.76 27.1,6.39 25.36,7.11 23.66,7.92 22,8.82 20.39,9.81 19.58,8.55 19.71,8.41 LED_9_4.C | 31.14,6.92 31.18,7.09 | 31.18,7.09 v32.49,11.99 | 31.14,6.92 LED_4_9.A | v77.04,34.13 77.3,36.08 77.45,38.04 77.5,38.2 77.5,38.23 LED_8_4.C | v32.52,4.79 32.83,6.25 32.89,6.3 LED_4_9.A | LED_2_4.C v66.49,51.8 | LED_3_4.C v66.49,28.2 | LED_5_4.C v22.95,16.54 | LED_6_4.C v11.16,36.97 | LED_7_4.C v18.45,59.41 | 31.18,7.09 31.11,7.11 31.14,6.92
  Bottom 0.381: v77.04,34.13 75.56,34.37 75.21,32.52 74.77,30.68 74.24,28.88 73.61,27.1 72.89,25.36 72.08,23.66 71.18,22 70.19,20.39 69.12,18.84 67.98,17.34 66.75,15.91 65.46,14.54 64.09,13.25 62.66,12.02 61.16,10.88 59.61,9.81 58,8.82 56.34,7.92 54.64,7.11 52.9,6.39 51.12,5.76 49.32,5.23 47.48,4.79 45.63,4.44 43.76,4.2 41.88,4.05 40,4 38.12,4.05 36.24,4.2 34.37,4.44 v32.52,4.79 | v40.93,22.27 v41.19,17.28 | v32.49,11.99 v34.11,18.02 | v66.49,51.8 v60.78,49.25 | v66.49,28.2 v60.78,30.75 | v22.95,16.54 v26.63,21.59 | v11.16,36.97 v17.38,37.62 | v18.45,59.41 v23.09,55.22
N_5  (via drill 0.3)
  Top 0.381: LED_5_1.A LED_5_2.A LED_5_3.A LED_5_4.A LED_5_6.A LED_5_7.A LED_5_8.A LED_5_9.A 9.48,24.45 | 36.28,63.46 35.06,63.23 33.85,62.94 v32.66,62.59 31.49,62.17 30.34,61.7 29.22,61.16 28.12,60.57 27.07,59.92 26.04,59.21 25.05,58.46 v24.11,57.65 23.21,56.79 22.35,55.89 21.54,54.95 20.79,53.96 20.08,52.94 19.43,51.88 18.84,50.78 18.3,49.66 17.83,48.51 17.41,47.34 17.06,46.15 16.77,44.94 16.54,43.72 16.38,42.48 16.28,41.24 v16.25,40 16.28,38.76 16.38,37.52 16.54,36.28 16.77,35.06 17.06,33.85 17.41,32.66 17.83,31.49 18.3,30.34 v18.84,29.22 19.43,28.12 20.08,27.07 20.79,26.04 21.54,25.05 22.35,24.11 23.21,23.21 24.11,22.35 25.05,21.54 26.04,20.79 27.07,20.08 28.12,19.43 29.22,18.84 30.34,18.3 31.49,17.83 32.66,17.41 33.85,17.06 35.06,16.77 36.28,16.54 37.52,16.38 v38.76,16.28 40,16.25 41.24,16.28 42.48,16.38 43.72,16.54 v44.94,16.77 46.15,17.06 47.34,17.41 48.51,17.83 49.66,18.3 50.78,18.84 51.88,19.43 52.94,20.08 53.96,20.79 54.95,21.54 55.89,22.35 56.79,23.21 57.65,24.11 58.46,25.05 59.21,26.04 59.92,27.07 v60.57,28.12 61.16,29.22 61.7,30.34 62.17,31.49 62.59,32.66 62.94,33.85 63.23,35.06 63.46,36.28 63.62,37.52 63.72,38.76 63.75,40 63.72,41.24 63.62,42.48 63.46,43.72 63.23,44.94 62.94,46.15 v62.59,47.34 62.17,48.51 61.7,49.66 61.16,50.78 60.57,51.88 59.92,52.94 59.21,53.96 58.46,54.95 57.65,55.89 56.79,56.79 55.89,57.65 54.95,58.46 53.96,59.21 52.94,59.92 51.88,60.57 50.78,61.16 49.66,61.7 LED_1_5.C | v39.07,22.27 38.2,22.34 37.33,22.45 36.46,22.61 35.61,22.8 34.76,23.04 33.93,23.32 34.53,24.96 34.54,25.04 RN5.2
  Top 0.381: 9.48,24.45 6.59,22.98 6.63,22.78 LED_9_5.C | 9.48,24.45 v14.16,26.83 | LED_2_5.C v67.58,48.96 | LED_3_5.C v65.11,25.5 | LED_4_5.C v46.03,11.63 | LED_6_5.C v11,40 | LED_7_5.C v20.59,61.55 | LED_8_5.C v31.04,67.58
  Bottom 0.381: v39.07,22.27 v38.76,16.28 | v14.16,26.83 v18.84,29.22 | v67.58,48.96 v62.59,47.34 | v65.11,25.5 v60.57,28.12 | v46.03,11.63 v44.94,16.77 | v11,40 v16.25,40 | v20.59,61.55 v24.11,57.65 | v31.04,67.58 v32.66,62.59
N_6  (via drill 0.3)
  Top 0.381: LED_6_1.A LED_6_2.A LED_6_3.A LED_6_4.A LED_6_5.A LED_6_7.A LED_6_8.A LED_6_9.A 8.03,52.27 | 36.13,64.44 v34.85,64.21 33.59,63.91 32.35,63.54 31.13,63.11 29.93,62.61 28.76,62.05 27.62,61.43 26.52,60.76 v25.45,60.02 24.42,59.23 23.44,58.39 22.5,57.5 21.61,56.56 20.77,55.58 19.98,54.55 19.24,53.48 18.57,52.38 17.95,51.24 17.39,50.07 v16.89,48.87 16.46,47.65 16.09,46.41 15.79,45.15 15.55,43.87 15.39,42.59 15.28,41.3 15.25,40 15.28,38.7 15.39,37.41 15.55,36.13 15.79,34.85 16.09,33.59 16.46,32.35 16.89,31.13 17.39,29.93 17.95,28.76 18.57,27.62 19.24,26.52 19.98,25.45 20.77,24.42 21.61,23.44 22.5,22.5 v23.44,21.61 24.42,20.77 25.45,19.98 26.52,19.24 27.62,18.57 28.76,17.95 29.93,17.39 31.13,16.89 32.35,16.46 33.59,16.09 34.85,15.79 v36.13,15.55 37.41,15.39 38.7,15.28 40,15.25 41.3,15.28 v42.59,15.39 43.87,15.55 45.15,15.79 46.41,16.09 47.65,16.46 48.87,16.89 50.07,17.39 51.24,17.95 52.38,18.57 53.48,19.24 54.55,19.98 55.58,20.77 56.56,21.61 57.5,22.5 58.39,23.44 59.23,24.42 v60.02,25.45 60.76,26.52 61.43,27.62 62.05,28.76 62.61,29.93 63.11,31.13 63.54,32.35 63.91,33.59 64.21,34.85 64.44,36.13 64.61,37.41 64.72,38.7 64.75,40 64.72,41.3 64.61,42.59 64.44,43.87 v64.21,45.15 63.91,46.41 63.54,47.65 63.11,48.87 62.61,50.07 62.05,51.24 61.43,52.38 60.76,53.48 60.02,54.55 59.23,55.58 58.39,56.56 57.5,57.5 56.56,58.39 55.58,59.23 54.55,60.02 53.48,60.76 52.38,61.43 LED_1_6.C | v37.07,21.48 36.1,21.66 35.15,21.89 34.21,22.17 33.28,22.5 32.37,22.87 31.49,23.29 30.62,23.76 29.79,24.27 28.98,24.83 28.2,25.43 27.45,26.07 26.74,26.74 26.07,27.45 25.43,28.2 24.83,28.98 24.27,29.79 23.76,30.62 26.14,32 26.21,32.03 RN6.2
  Top 0.381: 8.03,52.27 4.99,53.44 4.33,51.59 3.78,49.71 3.32,47.8 2.96,45.87 2.71,43.92 2.55,41.96 2.49,41.78 2.49,41.76 LED_9_6.C | 8.03,52.27 v12.93,50.39 | LED_2_6.C v68.37,46.03 | LED_3_6.C v63.46,22.95 | LED_4_6.C v43.03,11.16 | LED_5_6.C v20.59,18.45 | LED_7_6.C v22.95,63.46 | LED_8_6.C v33.97,68.37
  Bottom 0.381: v37.07,21.48 v36.13,15.55 | v12.93,50.39 v16.89,48.87 | v68.37,46.03 v64.21,45.15 | v63.46,22.95 v60.02,25.45 | v43.03,11.16 v42.59,15.39 | v20.59,18.45 v23.44,21.61 | v22.95,63.46 v25.45,60.02 | v33.97,68.37 v34.85,64.21
N_7  (via drill 0.3)
  Top 0.381: LED_7_1.A LED_7_2.A LED_7_3.A LED_7_4.A LED_7_5.A 18.35,66.48 | 18.35,66.48 LED_7_6.A LED_7_8.A LED_7_9.A | LED_1_7.C 55.13,60.83 56.2,60.01 57.23,59.14 58.21,58.21 59.14,57.23 60.01,56.2 60.83,55.13 61.6,54.02 62.3,52.88 62.94,51.69 63.52,50.47 64.04,49.23 64.49,47.96 64.87,46.66 65.19,45.35 65.43,44.03 v65.61,42.69 65.72,41.35 65.75,40 65.72,38.65 65.61,37.31 65.43,35.97 65.19,34.65 64.87,33.34 64.49,32.04 64.04,30.77 63.52,29.53 62.94,28.31 62.3,27.12 61.6,25.98 60.83,24.86 60.01,23.8 v59.14,22.77 58.21,21.79 57.23,20.86 56.2,19.99 55.13,19.17 54.02,18.4 52.88,17.7 51.69,17.06 50.47,16.48 49.23,15.96 47.96,15.51 46.66,15.13 45.35,14.81 44.03,14.57 42.69,14.39 41.35,14.29 v40,14.25 38.65,14.29 37.31,14.39 35.97,14.57 34.65,14.81 33.34,15.13 32.04,15.51 30.77,15.96 29.53,16.48 28.31,17.06 27.12,17.7 25.98,18.4 24.86,19.17 23.8,19.99 22.77,20.86 21.79,21.79 v20.86,22.77 19.99,23.8 19.17,24.86 18.4,25.98 17.7,27.12 17.06,28.31 16.48,29.53 15.96,30.77 15.51,32.04 15.13,33.34 14.81,34.65 14.57,35.97 14.39,37.31 14.29,38.65 14.25,40 14.29,41.35 v14.39,42.69 14.57,44.03 14.81,45.35 15.13,46.66 15.51,47.96 15.96,49.23 16.48,50.47 17.06,51.69 17.7,52.88 18.4,54.02 19.17,55.13 19.99,56.2 20.86,57.23 21.79,58.21 22.77,59.14 v23.8,60.01 24.86,60.83 25.98,61.6 27.12,62.3 28.31,62.94 29.53,63.52 30.77,64.04 32.04,64.49 33.34,64.87 34.65,65.19 35.97,65.43 v37.31,65.61 38.04,58.65 37.08,58.52 36.13,58.35 35.19,58.12 34.26,57.85 33.34,57.53 32.45,57.16 31.57,56.75 30.72,56.29 29.89,55.79 29.09,55.25 28.31,54.66 27.57,54.04 26.86,53.38 26.19,52.68 25.55,51.95 24.95,51.19 24.4,50.4 23.88,49.58 23.41,48.73 22.98,47.87 22.6,46.98 22.26,46.07 21.97,45.14 21.73,44.2 21.54,43.26 24.24,42.78 24.36,42.77 RN7.2
  Top 0.381: 18.59,66.44 16.4,69.14 14.91,67.87 13.48,66.52 12.13,65.09 10.86,63.6 9.66,62.04 8.55,60.42 8.41,60.3 LED_9_7.C | 18.59,66.44 v21.75,62.54 | LED_2_7.C v68.84,43.03 | LED_3_7.C v61.55,20.59 | LED_4_7.C v40,11 | LED_5_7.C v18.45,20.59 | LED_6_7.C v11.16,43.03 | LED_8_7.C v36.97,68.84 | 18.59,66.44 18.47,66.34 18.35,66.48
  Bottom 0.381: v21.75,62.54 v23.8,60.01 | v68.84,43.03 v65.61,42.69 | v61.55,20.59 v59.14,22.77 | v40,11 v40,14.25 | v18.45,20.59 v20.86,22.77 | v11.16,43.03 v14.39,42.69 | v36.97,68.84 v37.31,65.61
N_8  (via drill 0.3)
  Top 0.381: LED_8_5.A LED_8_6.A LED_8_7.A 38.17,74.15 | 38.17,74.15 LED_8_9.A | LED_1_8.C 57.9,59.88 58.91,58.91 59.88,57.9 60.79,56.83 61.64,55.72 62.43,54.57 63.17,53.38 63.83,52.14 64.44,50.88 64.97,49.59 65.44,48.27 65.84,46.92 66.17,45.56 66.42,44.19 66.6,42.8 66.71,41.4 v66.75,40 66.71,38.6 66.6,37.2 66.42,35.81 66.17,34.44 65.84,33.08 65.44,31.73 64.97,30.41 64.44,29.12 63.83,27.86 63.17,26.62 62.43,25.43 61.64,24.28 60.79,23.17 59.88,22.1 58.91,21.09 v57.9,20.12 56.83,19.21 55.72,18.36 54.57,17.57 53.38,16.83 52.14,16.17 50.88,15.56 49.59,15.03 48.27,14.56 46.92,14.16 45.56,13.84 44.19,13.58 42.8,13.4 41.4,13.29 40,13.25 38.6,13.29 v37.2,13.4 35.81,13.58 34.44,13.84 33.08,14.16 31.73,14.56 30.41,15.03 29.12,15.56 27.86,16.17 26.62,16.83 25.43,17.57 24.28,18.36 23.17,19.21 22.1,20.12 21.09,21.09 20.12,22.1 19.21,23.17 v18.36,24.28 17.57,25.43 16.83,26.62 16.17,27.86 15.56,29.12 15.03,30.41 14.56,31.73 14.16,33.08 13.84,34.44 13.58,35.81 13.4,37.2 13.29,38.6 13.25,40 13.29,41.4 13.4,42.8 13.58,44.19 v13.84,45.56 14.16,46.92 14.56,48.27 15.03,49.59 15.56,50.88 16.17,52.14 16.83,53.38 17.57,54.57 18.36,55.72 19.21,56.83 20.12,57.9 21.09,58.91 22.1,59.88 23.17,60.79 24.28,61.64 25.43,62.43 v26.62,63.17 27.86,63.83 29.12,64.44 30.41,64.97 31.73,65.44 33.08,65.84 34.44,66.17 35.81,66.42 37.2,66.6 v38.6,66.71 39.07,57.73 38.19,57.66 37.32,57.55 36.45,57.39 35.59,57.19 34.74,56.95 33.91,56.67 33.09,56.35 32.28,55.98 31.5,55.58 30.74,55.14 30,54.66 29.28,54.15 28.59,53.6 29.71,52.26 29.79,52.17 RN8.2
  Top 0.381: 72.71,61.24 73.78,59.5 74.75,57.71 75.63,55.86 76.41,53.98 77.09,52.05 77.67,50.09 78.15,48.11 78.52,46.1 78.79,44.08 78.95,42.04 77.49,41.97 | 72.71,61.24 71.55,62.92 70.31,64.54 68.98,66.1 67.58,67.58 66.1,68.98 64.54,70.31 62.92,71.55 61.24,72.71 59.5,73.78 57.71,74.75 | 57.71,74.75 55.86,75.63 53.98,76.41 52.05,77.09 50.09,77.67 48.11,78.15 46.1,78.52 44.08,78.79 42.04,78.95 40,79 37.96,78.95 | 37.96,78.95 35.92,78.79 33.9,78.52 31.89,78.15 29.91,77.67 27.95,77.09 26.02,76.41 24.14,75.63 22.29,74.75 22.95,73.47 | 77.49,41.97 77.45,41.96 | 72.71,61.24 71.5,60.46 | 71.5,60.46 71.45,60.42 | 57.71,74.75 57.04,73.44 | 57.04,73.44 57.02,73.41 | 37.96,78.95 38.04,77.45 | 22.95,73.47 22.98,73.41 | 38.04,77.45 38.09,76.45 | 38.09,76.45 38.21,74.2 | v38.48,68.96 38.22,73.97 | 38.22,73.97 38.09,76.45 | LED_2_8.C v69,40 | LED_3_8.C v59.41,18.45 | LED_4_8.C v36.97,11.16 | LED_5_8.C v16.54,22.95 | LED_6_8.C v11.63,46.03 | LED_7_8.C v25.5,65.11 | LED_9_8.C 22.78,73.36 22.78,73.38 22.95,73.47 | 38.22,73.97 38.18,73.97 38.17,74.15 | LED_8_1.A 38.23,77.5 38.2,77.5 38.04,77.45 | LED_8_4.A 77.5,41.78 77.49,41.97 | LED_8_2.A 57.2,73.36 57.04,73.44 | LED_8_3.A 71.6,60.3 71.5,60.46
  Bottom 0.381: v38.6,66.71 v38.48,68.96 | v69,40 v66.75,40 | v59.41,18.45 v57.9,20.12 | v36.97,11.16 v37.2,13.4 | v16.54,22.95 v18.36,24.28 | v11.63,46.03 v13.84,45.56 | v25.5,65.11 v26.62,63.17
N_9
  Top 0.381: 40,67.75 38.55,67.71 37.1,67.6 35.66,67.41 34.23,67.14 32.82,66.8 31.43,66.39 30.05,65.91 | 30.05,65.91 28.71,65.35 | 28.71,65.35 27.4,64.72 26.12,64.03 24.89,63.27 23.69,62.45 22.54,61.57 21.43,60.62 20.38,59.62 19.38,58.57 18.43,57.46 17.55,56.31 16.73,55.11 15.97,53.88 15.28,52.6 14.65,51.29 14.09,49.95 13.61,48.58 | 13.61,48.58 13.2,47.18 12.86,45.77 12.59,44.34 12.4,42.9 12.29,41.45 12.25,40 12.29,38.55 12.4,37.1 12.59,35.66 12.86,34.23 13.2,32.82 13.61,31.43 14.09,30.05 14.65,28.71 15.28,27.4 15.97,26.12 | 15.97,26.12 16.73,24.89 17.55,23.69 18.43,22.54 19.38,21.43 20.38,20.38 21.43,19.38 22.54,18.43 23.69,17.55 24.89,16.73 26.12,15.97 27.4,15.28 28.71,14.65 30.05,14.09 31.43,13.61 32.82,13.2 34.23,12.86 | 34.23,12.86 35.66,12.59 37.1,12.4 38.55,12.29 40,12.25 41.45,12.29 42.9,12.4 44.34,12.59 45.77,12.86 47.18,13.2 48.58,13.61 49.95,14.09 51.29,14.65 52.6,15.28 53.88,15.97 55.11,16.73 56.31,17.55 | 56.31,17.55 57.46,18.43 58.57,19.38 59.62,20.38 60.62,21.43 61.57,22.54 62.45,23.69 63.27,24.89 64.03,26.12 64.72,27.4 65.35,28.71 65.91,30.05 66.39,31.43 66.8,32.82 67.14,34.23 67.41,35.66 67.6,37.1 | 67.6,37.1 67.71,38.55 67.75,40 67.71,41.45 67.6,42.9 67.41,44.34 67.14,45.77 66.8,47.18 66.39,48.58 65.91,49.95 65.35,51.29 64.72,52.6 64.03,53.88 63.27,55.11 62.45,56.31 61.57,57.46 60.62,58.57 LED_1_9.C | 40,67.56 40,56 RN9.2 | 40,67.56 40,67.75 | 40,67.75 LED_8_9.C | 5.25,57.71 6.22,59.5 7.29,61.24 8.45,62.92 9.69,64.54 11.02,66.1 12.42,67.58 13.9,68.98 15.46,70.31 17.08,71.55 18.76,72.71 19.56,71.48 | 5.25,57.71 4.37,55.86 3.59,53.98 2.91,52.05 2.33,50.09 1.85,48.11 1.48,46.1 1.21,44.08 1.05,42.04 1,40 1.05,37.96
  Top 0.381: 1.05,37.96 1.21,35.92 1.48,33.9 1.85,31.89 2.33,29.91 2.91,27.95 3.59,26.02 4.37,24.14 5.25,22.29 6.22,20.5 7.29,18.76 | 7.29,18.76 8.45,17.08 9.69,15.46 11.02,13.9 12.42,12.42 13.9,11.02 15.46,9.69 17.08,8.45 18.76,7.29 20.5,6.22 22.29,5.25 | 22.29,5.25 24.14,4.37 26.02,3.59 27.95,2.91 29.91,2.33 31.89,1.85 33.9,1.48 35.92,1.21 37.96,1.05 40,1 42.04,1.05 | 42.04,1.05 44.08,1.21 46.1,1.48 48.11,1.85 50.09,2.33 52.05,2.91 53.98,3.59 55.86,4.37 57.71,5.25 59.5,6.22 61.24,7.29 | 61.24,7.29 62.92,8.45 64.54,9.69 66.1,11.02 67.58,12.42 68.98,13.9 70.31,15.46 71.55,17.08 72.71,18.76 73.78,20.5 74.75,22.29 73.43,22.96 | 19.56,71.48 19.58,71.45 20.39,70.19 22,71.18 23.66,72.08 25.36,72.89 27.1,73.61 30.05,65.91 | 5.25,57.71 6.57,57.03 | 6.57,57.03 6.59,57.02 | 1.05,37.96 2.5,38.03 | 2.5,38.03 2.55,38.04 | 7.29,18.76 8.51,19.55 | 8.51,19.55 8.55,19.58 | 22.29,5.25 22.95,6.54 | 22.95,6.54 22.98,6.59 | 42.04,1.05 41.97,2.5 | 41.97,2.5 41.96,2.55 | 61.24,7.29 60.43,8.54 | 60.43,8.54 60.42,8.55 | 73.43,22.96 73.41,22.98 | LED_2_9.C 67.6,37.1 | LED_3_9.C 56.31,17.55 | LED_4_9.C 34.23,12.86 | LED_5_9.C 15.97,26.12 | LED_6_9.C 13.61,48.58 | LED_7_9.C 28.71,65.35 | LED_9_5.A 8.41,19.71 8.51,19.55 | 22.95,6.54 22.78,6.63 LED_9_4.A | LED_9_6.A 2.49,38.23 2.49,38.2 2.5,38.03 | LED_9_3.A 41.76,2.49 41.78,2.49 41.97,2.5 | LED_9_7.A 6.66,57.2 6.57,57.03 | LED_9_2.A 60.27,8.43 60.43,8.54 | LED_9_8.A 19.71,71.58 19.56,71.48 | LED_9_1.A 73.36,22.78 73.36,22.81 73.43,22.96 | 40,67.56 40.01,67.56 40,67.75
PB0  (via drill 0.3)
  Top 0.381: v39.6,34.59 39.34,34.59 38.96,34.98 IC2.8 | v41.22,36.73 v38.08,39.88
  Bottom 0.381: v39.6,34.59 41.48,36.47 | 41.48,36.47 41.96,36.96 41.96,37.13 42.01,37.19 42.01,37.24 42.09,37.31 42.09,37.36 42.16,37.44 42.16,37.49 42.24,37.57 42.24,37.62 42.29,37.67 42.29,37.72 42.37,37.8 42.37,37.85 42.44,37.92 42.44,37.97 42.49,38.02 42.49,38.08 42.57,38.15 42.57,38.2 43.1,38.73 43.87,38.73 C2.1 | v38.08,39.88 38.89,40.69 Q1.3 | v41.22,36.73 41.48,36.47
PB1  (via drill 0.3)
  Top 0.381: v35.69,35.92 36.35,35.26 36.35,35.08 36.73,34.7 37.29,34.7 38.12,35.53 38.35,35.53 IC2.7
  Bottom 0.381: Q1.1 39.6,38.05 39.17,38.05 39.04,37.92 38.33,37.92 37.69,37.29 36.98,37.29 C1.1 36.85,37.11 35.69,35.94 v35.69,35.92
PC0
  Top 0.381: IC2.23 42.6,45.41 39.98,48.03 CN9.1
PC1  (via drill 0.3)
  Top 0.381: v41.02,46.02 41.05,46 41.05,45.03 IC2.24 | v43.92,45.77 44.02,45.77 45.52,44.27 46.99,44.27 v48.49,42.77 | v48.49,40.21 50.37,40.21 v50.44,40.13
  Bottom 0.381: v41.02,46.02 43.66,46.02 v43.92,45.77 | v48.49,40.21 v48.49,42.77 | v50.44,40.13 51.33,40.13 52.58,41.38 52.58,41.48 52.6,41.5 52.6,41.58 UPSW.A2
PC2  (via drill 0.3)
  Top 0.381: v37.52,46.46 38.94,45.03 IC2.25 39.06,44.86 42.27,41.66 42.44,41.66 43.1,41 | v35.76,32.97 v32.51,32.97 | v41.27,38.28 41.27,39.17 43.1,41 | v49.94,35 50.22,35.28 49.81,35.69 49.76,35.69 49.68,35.76 49.63,35.76 49.55,35.84 49.51,35.84 49.43,35.92 49.38,35.92 49.33,35.97 49.28,35.97 49.2,36.04 49.15,36.04 49.07,36.12 49.02,36.12 48.97,36.17 48.92,36.17 48.84,36.25 48.79,36.25 48.72,36.32 48.67,36.32 48.59,36.4 48.54,36.4 46.86,38.08 46.79,38.08 44.91,39.95 44.25,39.95 43.28,40.92 43.1,41
  Bottom 0.381: v37.52,46.46 37.52,47.35 39.32,49.15 39.4,49.15 39.45,49.2 39.5,49.2 39.52,49.23 39.57,49.23 39.62,49.28 39.67,49.28 40.66,50.27 | 40.66,50.27 41.99,51.59 RS1.1 | 40.66,50.27 39.4,51.54 39.4,52.12 39.55,52.27 39.06,52.76 37.44,52.76 36.4,53.8 32.87,53.8 32.23,53.16 31.95,53.16 29.97,51.18 29.92,51.18 29.82,51.08 28.8,51.08 DOWNSW.A2 | v32.51,32.97 32.03,32.49 30.96,32.49 RS2.1 | v35.76,32.97 35.97,32.97 v41.27,38.28 | v49.94,35 50.85,35.92 51.03,35.92 RS3.1
PC3  (via drill 0.3)
  Top 0.381: v36.85,45.97 38.35,44.48 38.35,44.45 IC2.26
  Bottom 0.381: v36.85,45.97 36.85,50.44 38,51.59 RR1.2
PC4  (via drill 0.3)
  Top 0.381: v35.53,44.45 35.66,44.32 37.13,44.32 37.57,43.89 37.8,43.89 IC2.27
  Bottom 0.381: v35.53,44.45 35.18,44.45 34.34,43.61 34.34,43.43 32.79,41.88 32.79,39.78 28.96,35.94 RR2.2
PC5  (via drill 0.3)
  Top 0.381: v42.16,41 40.28,42.88 37.92,42.88 37.49,43.31 37.26,43.31 IC2.28
  Bottom 0.381: v42.16,41 45.77,41 48.21,43.43 50.72,43.43 53.47,46.18 54.94,46.18 59.05,42.06 52.93,35.94 52.93,35.89 51.54,34.49 51.54,34.47 51.51,34.44 51.46,34.44 51.44,34.42 51.38,34.42 51.36,34.39 51.28,34.39 51.26,34.37 50.93,34.37 49.05,32.49 RR3.2
PD0  (via drill 0.3)
  Top 0.381: v35.46,43.08 36.09,42.44 36.09,42.19 IC2.30 | v43.97,46.69 44.65,46.69 CN1.1
  Bottom 0.381: v35.46,43.08 36.07,42.47 38.46,44.86 38.91,44.86 40.74,46.69 v43.97,46.69
PD1  (via drill 0.3)
  Top 0.381: v37.97,41.17 36.25,41.17 35.81,41.6 35.56,41.6 IC2.31 | v45.47,42.9 46.41,42.9 47.9,41.4 CN2.1
  Bottom 0.381: v37.97,41.17 38.41,41.6 41.83,41.6 41.88,41.66 44.22,41.66 v45.47,42.9
PD2  (via drill 0.3)
  Top 0.381: v38.43,33.93 38.2,34.16 36.5,34.16 33.48,37.19 33.48,37.24 32.92,37.8 34.98,39.85 34.98,41.05 IC2.32 | v45.82,35.1 46.84,36.12 46.97,35.99 CN3.1
  Bottom 0.381: v38.43,33.93 41,33.93 43.03,35.97 43.79,35.97 45.24,34.52 v45.82,35.1
PD3
  Top 0.381: IC2.1 35,38.96 36.07,40.03 38.79,37.31 38.79,36.55 39.95,35.38 39.95,35.2 42.75,32.41 CN4.1
PD4  (via drill 0.3)
  Top 0.381: v34.37,37.24 34.39,37.21 35.53,38.35 IC2.2 | v33.53,34.54 33.71,34.54 34.29,33.96 34.8,33.96 34.92,33.83 35.84,33.83 37.24,32.44 CN5.1
  Bottom 0.381: v34.37,37.24 34.37,35.38 v33.53,34.54
PD5  (via drill 0.3)
  Top 0.381: v39.45,37.39 40.62,36.22 40.62,35.66 41.05,35.23 41.05,35 IC2.9 | v35.2,34.49 34.52,34.49 33.05,35.97 CN6.1
  Bottom 0.381: v39.45,37.39 38.56,37.39 37.92,36.75 37.87,36.75 37.8,36.68 37.74,36.68 37.67,36.6 37.62,36.6 37.57,36.55 37.52,36.55 37.44,36.47 37.39,36.47 37.31,36.4 37.26,36.4 37.21,36.35 37.16,36.35 37.08,36.27 37.03,36.27 36.96,36.2 36.91,36.2 v35.2,34.49
PD6  (via drill 0.3)
  Top 0.381: v42.52,33.58 42.06,34.04 42.06,34.87 41.63,35.31 41.63,35.53 IC2.10 | v28.17,27.71 28.17,27.89 v25.55,30.5 | v28.85,46.13 28.85,45.95 29.01,45.8 29.01,45.74 29.06,45.7 29.06,45.62 29.11,45.57 29.11,44.81 31.27,42.65 31.27,42.6 31.34,42.52 31.34,42.11 32.05,41.4 CN7.1
  Bottom 0.381: v42.52,33.58 42.52,32.69 40.69,30.86 40.64,30.86 40.59,30.81 40.51,30.81 40.46,30.76 40.39,30.76 40.34,30.71 40.28,30.71 40.26,30.68 32.16,30.68 31.7,30.23 30.68,30.23 v28.17,27.71 | v25.55,30.5 25.55,30.58 26.62,31.65 26.62,31.7 26.64,31.73 26.64,31.77 26.82,31.95 26.82,32.69 27.05,32.92 27.05,32.99 27.99,33.93 27.99,34.01 28.02,34.04 28.02,34.09 28.04,34.11 28.04,35 26.36,36.68 25.88,36.2 25.32,36.2 22.12,39.4 v28.85,46.13
PD7  (via drill 0.3)
  Top 0.381: v44.4,32.74 43.51,33.63 43.51,33.93 42.62,34.82 42.62,35.43 42.19,35.87 42.19,36.09 IC2.11 | v32.36,37.26 32.36,39.75 33.98,41.38 33.98,45.31 34.82,46.15 CN8.1
  Bottom 0.381: v44.4,32.74 44.4,32.69 42.22,30.5 41.1,30.5 40.92,30.33 40.87,30.33 40.82,30.28 40.74,30.28 40.69,30.23 40.62,30.23 40.56,30.18 40.51,30.18 40.49,30.15 32.38,30.15 31.93,29.69 31.09,29.69 28.45,27.05 27.89,27.05 27.23,27.71 30,30.48 30,30.56 30.02,30.58 30.02,30.66 30.05,30.68 30.05,31.75 28.45,33.35 v32.36,37.26
ROTOR1
  Bottom 0.381: 41.6,70.46 40.84,55.98 40.66,55.91 40.58,55.82 | 40.58,55.82 39.17,54.41 38.02,54.41 RR1.1 | 40.58,55.82 41.99,54.41 RS1.2
  pour Bottom: 439 corners
ROTOR2
  Bottom 0.381: 13.59,24.75 24.27,30.92 | 24.27,30.92 26.14,32 26.26,32.16 26.29,32.18 26.29,32.92 26.52,33.15 26.52,34.52 RR2.1 | RS2.2 27.05,31.06 25.83,29.84 25.27,29.84 24.36,30.76 24.27,30.92
  pour Bottom: 440 corners
ROTOR3
  Bottom 0.381: 65.58,23.39 53.42,31.29 | RR3.1 51.49,31.09 53.19,31.09 53.26,31.17 53.42,31.29 | RS3.2 53.47,34.52 53.47,31.47 53.42,31.29
  pour Bottom: 440 corners
VCC  (via drill 0.3)
  Top 0.381: v43.64,43.99 43.64,43.84 44.88,42.6 44.88,42.06 IC2.18 | 52.73,40.26 51.94,41.05 51.94,41.12 51.92,41.15 51.92,41.25 51.89,41.27 51.89,41.4 51.87,41.43 51.87,41.55 50.62,42.8 50.62,42.82 50.49,42.95 50.44,42.95 50.39,43 49.2,43 48.77,43.43 48.59,43.43 47.22,44.81 45.92,44.81 v45.8,44.93 | 52.73,40.26 53.44,39.55 53.62,39.55 NPN2.C | v50.52,47.12 50.75,47.35 50.75,48.39 NPN1.C | v45.85,48.95 42.85,51.94 NPN9.C | 41.35,26.49 39.98,26.49 v39.01,27.46 | 41.35,26.49 41.88,26.49 NPN4.C | v46.43,30.86 NPN3.C | v43.28,28.6 41.35,26.67 41.35,26.49 | 36.68,37.24 IC2.4 36.83,37.36 36.83,37.39 37.39,37.95 38.25,37.08 38.25,36.55 37.95,36.25 IC2.6 | IC2.6 | 32.77,31.29 32.77,28.45 NPN5.C 32.84,28.25 34.82,26.26 v35.53,26.26 | 30.4,33.66 29.11,34.95 29.03,34.95 29.01,34.98 28.93,34.98 28.91,35 27.79,35 27.03,35.76 NPN6.C 26.98,35.97 26.62,36.32 v26.62,38.2 | 30.4,33.66 32.77,31.29 | v27.33,43.64 NPN7.C | v35.13,50.52 33.6,52.05 NPN8.C | v30.56,33.81 30.4,33.66 | v37.01,35.36 37.03,35.33 37.67,35.97 37.67,35.99 IC2.6 | v32.99,31.34 32.94,31.34 32.77,31.29 | v52.48,40.01 52.73,40.26
  Bottom 0.381: C3.1 40.87,43.99 v43.64,43.99 43.81,44.07 44.68,44.93 v45.8,44.93 45.97,45.01 47.55,46.58 | v50.52,47.12 49.33,47.12 48.79,46.58 47.55,46.58 | v45.85,48.95 45.85,48.39 47.47,46.76 47.55,46.58 | v39.01,27.46 37.72,27.46 37.26,27 V+.TP 36.83,27 36.27,27 v35.53,26.26 | v46.43,30.86 44.3,28.73 43.41,28.73 | v43.28,28.6 43.41,28.73 | v26.62,38.2 26.64,38.23 26.64,38.89 27.33,39.57 v27.33,43.64 27.51,43.71 30.05,46.25 31.04,46.25 32.23,47.45 32.87,47.45 32.89,47.47 32.97,47.47 32.99,47.5 33.07,47.5 35.13,49.55 v35.13,50.52 | v30.56,33.81 32.74,35.99 VCC.TP | v32.99,31.34 v37.01,35.36 | v52.48,40.01 52.48,39.32 48.21,35.05 48.21,34.52 43.36,29.67 43.36,28.91 43.41,28.73

## Text on the board
Bottom: 3 | 1 | 0 | 2 | - | 9 | 2 | - | 1 | 1 | y | r | 1 | v | u | b | x | a | u | d | t | n | a | a | i | y | r | d | b | a | r